# Altium project UCLA-DRS4-2.1.PrjPCB (part 1 of 7)
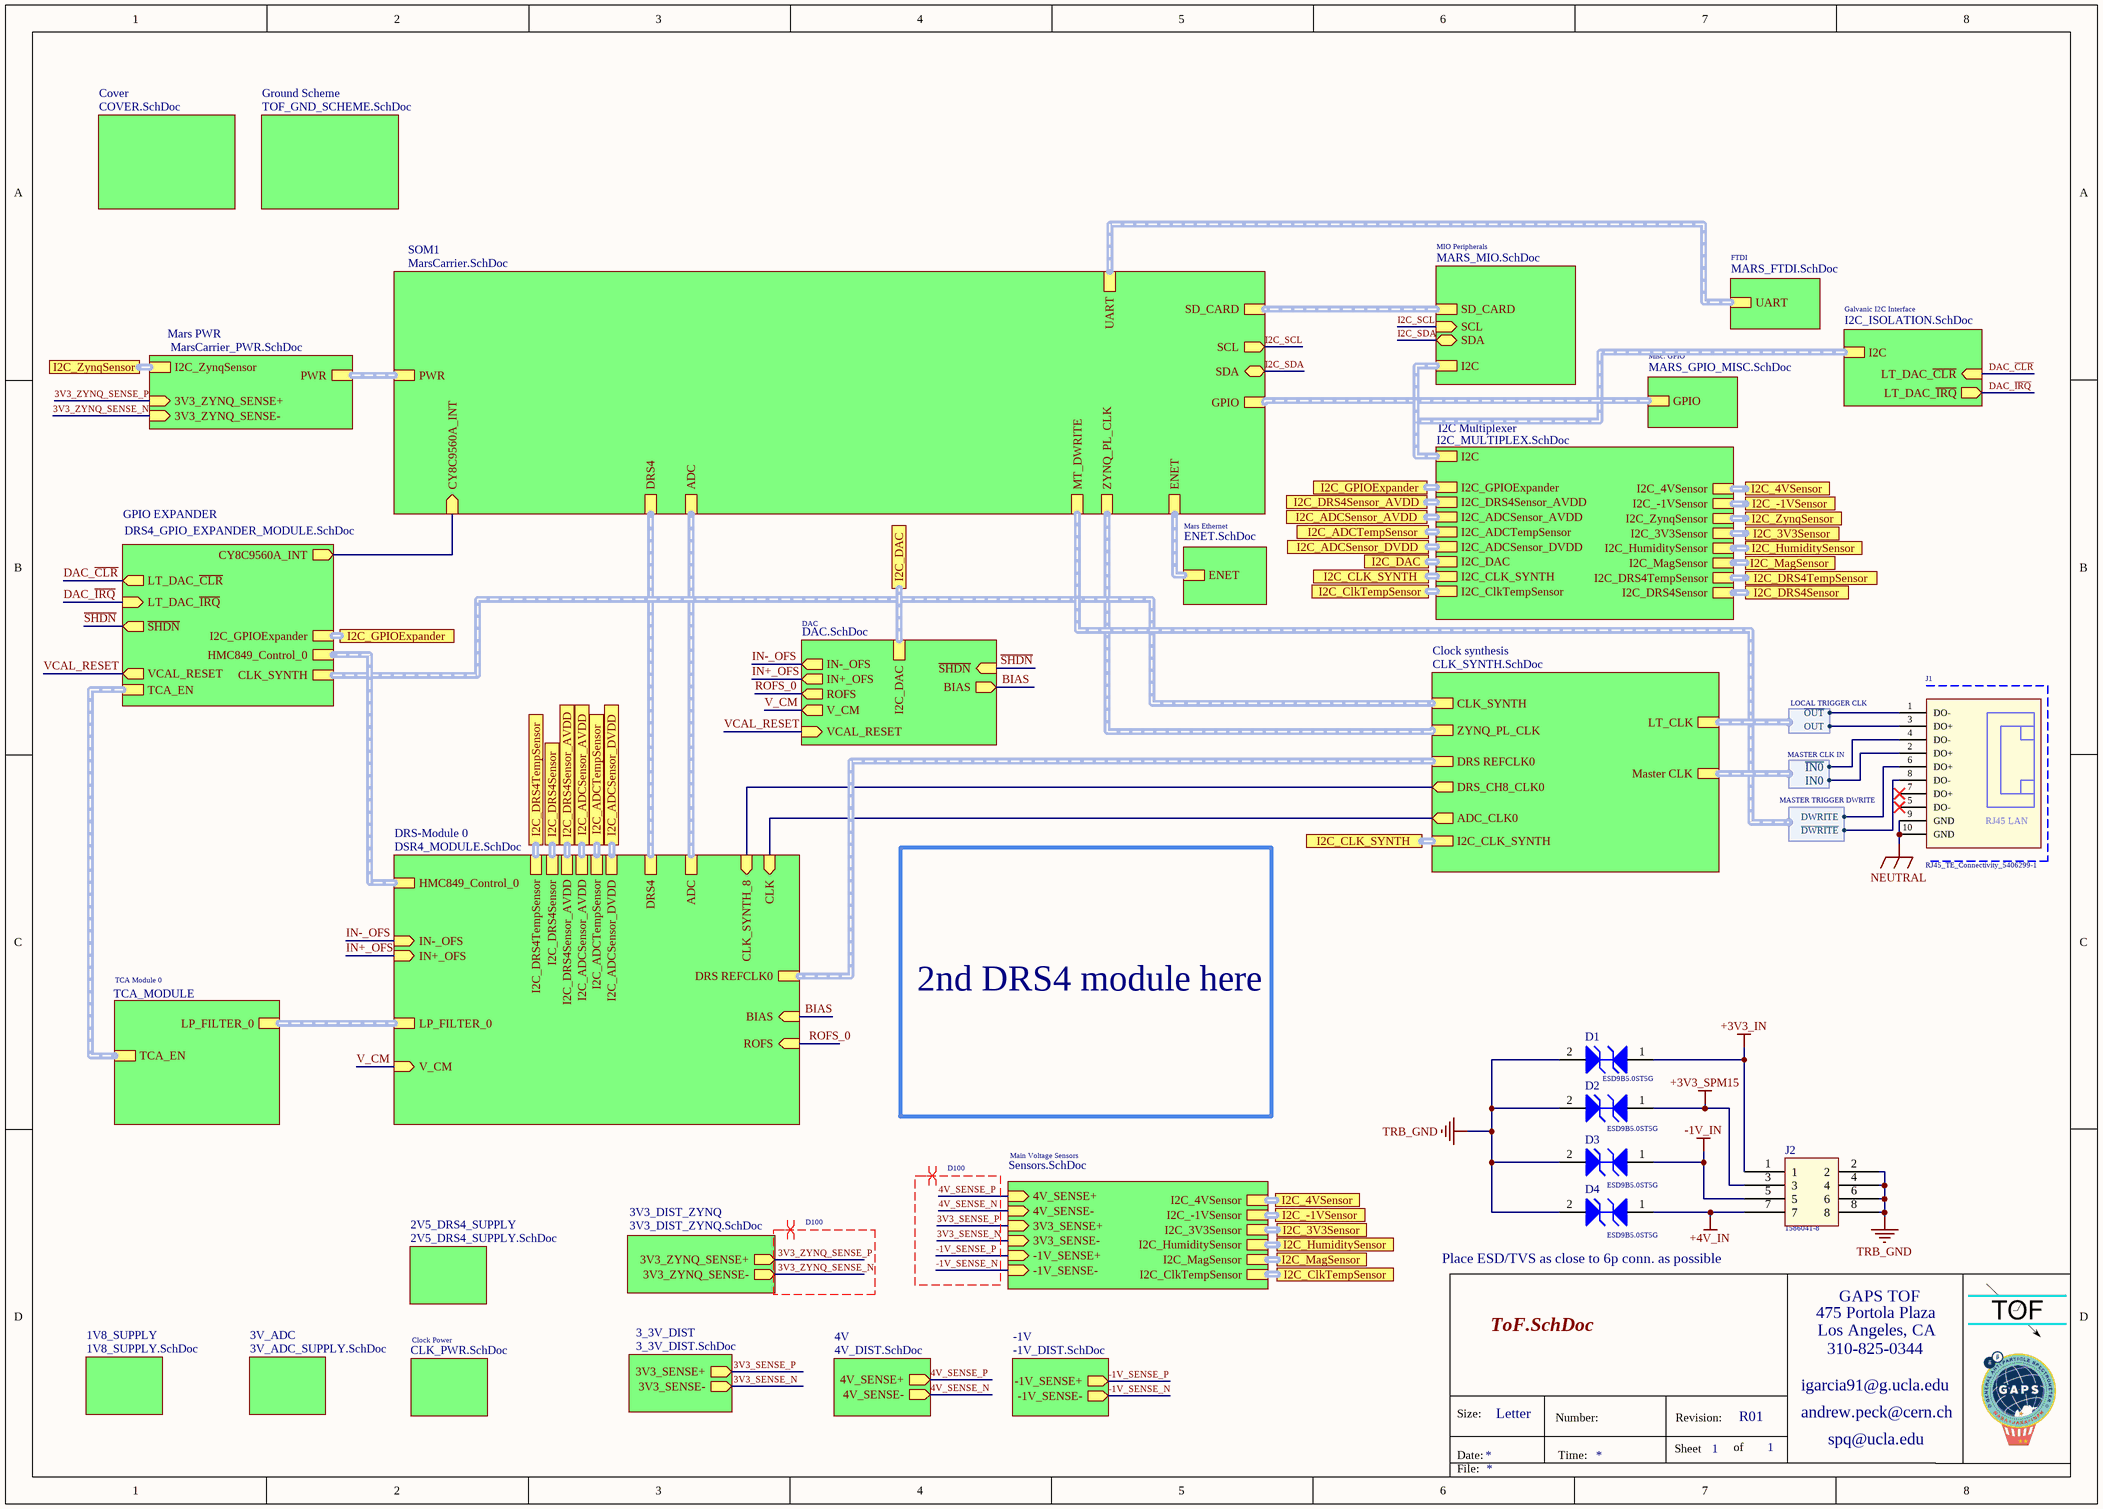
[diagram p0: ToF.SchDoc]
34 sheets, 1411 parts. Net scope: hierarchical (ports join the sheet entries above them; power ports are global).
Board file: DRS4-PCB.PcbDoc
Sheets:
  ToF.SchDoc
    DRS-Module 0 = DSR4_MODULE.SchDoc
      DRS1 = DRS4.SchDoc
      FE0 = ANA_FE.SchDoc
      ADC = DRS4_ADC.SchDoc
      FE2 = ANA_FE.SchDoc
      FE4 = ANA_FE.SchDoc
      FE6 = ANA_FE.SchDoc
      FE1 = ANA_FE.SchDoc
      FE3 = ANA_FE.SchDoc
      FE5 = ANA_FE.SchDoc
      FE7 = ANA_FE.SchDoc
      FE8 = ANA_FE_CLK_SYNTH.SchDoc
    SOM1 = MarsCarrier.SchDoc
    Mars Ethernet = ENET.SchDoc
    DAC = DAC.SchDoc
    Clock synthesis = CLK_SYNTH.SchDoc
    TCA Module 0 = TCA_MODULE.SchDoc
      TCA CLK = TCA_CLK_DIST.SchDoc
      TCA FILTER = TCA_LP_FILTER.SchDoc
    MIO Peripherals = MARS_MIO.SchDoc
    Clock Power = CLK_PWR.SchDoc
    2V5_DRS4_SUPPLY = 2V5_DRS4_SUPPLY.SchDoc
    4V = 4V_DIST.SchDoc
    -1V = -1V_DIST.SchDoc
    3V_ADC = 3V_ADC_SUPPLY.SchDoc
    Mars PWR = MarsCarrier_PWR.SchDoc
      MarsZX2 PWR Reset = MARS_PORB.SchDoc
    3V3_DIST_ZYNQ = 3V3_DIST_ZYNQ.SchDoc
    3_3V_DIST = 3_3V_DIST.SchDoc
    Main Voltage Sensors = Sensors.SchDoc
    Misc. GPIO = MARS_GPIO_MISC.SchDoc
    FTDI = MARS_FTDI.SchDoc
    GPIO EXPANDER = DRS4_GPIO_EXPANDER_MODULE.SchDoc
      I2C GPIO = DRS4_GPIO_EXPANDER.SchDoc
      I2C GPIO LED = GPIO_EXPANDER_LED.SchDoc
    Galvanic I2C Interface = I2C_ISOLATION.SchDoc
    I2C Multiplexer = I2C_MULTIPLEX.SchDoc
    1V8_SUPPLY = 1V8_SUPPLY.SchDoc
    Cover = COVER.SchDoc
    Ground Scheme = TOF_GND_SCHEME.SchDoc

## Sheet ToF.SchDoc: My title
size A3; Organization: University of California; Address1: 475 Portola Plaza; Address2: Los Angeles, CA 90095; Revision: R01; SheetNumber: 1; SheetTotal: 1

### Parts
D1  ESD9B5.0ST5G  [ONSC-SOD-923-2-514AB-01_V]
D2  ESD9B5.0ST5G  [ONSC-SOD-923-2-514AB-01_V]
D3  ESD9B5.0ST5G  [ONSC-SOD-923-2-514AB-01_V]
D4  ESD9B5.0ST5G  [ONSC-SOD-923-2-514AB-01_V]
J1  RJ45_TE_Connectivity_5406299-1  [RJ45_TE_Connectivity_5406299-1]
J2  Series: 1586041-8  [Header_TE_Connectivity_1586041-8_8POS]  (hidden comment: Header_TE_Connectivity_1586041-8_8POS)

### Sub-sheets
1V8_SUPPLY = 1V8_SUPPLY.SchDoc: no entries
2V5_DRS4_SUPPLY = 2V5_DRS4_SUPPLY.SchDoc: no entries
3_3V_DIST = 3_3V_DIST.SchDoc: 3V3_SENSE- (out), 3V3_SENSE+ (out)
3V3_DIST_ZYNQ = 3V3_DIST_ZYNQ.SchDoc: 3V3_ZYNQ_SENSE- (out), 3V3_ZYNQ_SENSE+ (out)
3V_ADC = 3V_ADC_SUPPLY.SchDoc: no entries
4V = 4V_DIST.SchDoc: 4V_SENSE- (out), 4V_SENSE+ (out)
-1V = -1V_DIST.SchDoc: -1V_SENSE- (out), -1V_SENSE+ (out)
Clock Power = CLK_PWR.SchDoc: no entries
Clock synthesis = CLK_SYNTH.SchDoc: CLK_SYNTH (harness CLK SYNTH CONTROL), ZYNQ_PL_CLK (harness ZYNQ PL CLK), DRS REFCLK0 (harness DRS4 REFCLK0), DRS_CH8_CLK0 (out), Master CLK (harness MASTER CLK IN), ADC_CLK0 (out), I2C_CLK_SYNTH (harness Clock Synth I2C), LT_CLK (harness LOCAL TRIGGER CLK)
Cover = COVER.SchDoc: no entries
DAC = DAC.SchDoc: I2C_DAC (harness DAC  I2C), IN-_OFS (out), IN+_OFS (out), ROFS (out), V_CM (out), VCAL_RESET (in), ~{SHDN} (in), BIAS (out)
DRS-Module 0 = DSR4_MODULE.SchDoc: ADC (harness ADC), DRS4 (harness DRS4), DRS REFCLK0 (harness DRS4 REFCLK 0), BIAS (in), ROFS (in), HMC849_Control_0 (harness HMC849 Control 0), LP_FILTER_0 (harness TCA Filter 0), V_CM (in), CLK_SYNTH_8 (in), IN-_OFS (in), IN+_OFS (in), CLK (in), I2C_DRS4TempSensor (harness Clk Synth Temp Sensor I2C), I2C_DRS4Sensor (harness DRS4 Current Sensor I2C), I2C_DRS4Sensor_AVDD (harness DRS4 Current Sensor I2C), I2C_ADCSensor_AVDD (harness ADC AVDD Current Sensor I2C), I2C_ADCTempSensor (harness ADC Temp Sensor I2C), I2C_ADCSensor_DVDD (harness ADC DVDD Current Sensor I2C)
FTDI = MARS_FTDI.SchDoc: UART (harness Mars UART)
Galvanic I2C Interface = I2C_ISOLATION.SchDoc: I2C (harness Mars I2C), LT_DAC_~{CLR} (in), LT_DAC_~{IRQ} (out)
GPIO EXPANDER = DRS4_GPIO_EXPANDER_MODULE.SchDoc: HMC849_Control_0 (harness HMC849 Control 0), CLK_SYNTH (harness CLK SYNTH CONTROL), TCA_EN (harness TCA EN), ~{SHDN} (out), VCAL_RESET (out), LT_DAC_~{CLR} (out), LT_DAC_~{IRQ} (in), CY8C9560A_INT (out), I2C_GPIOExpander (harness GPIO Expander I2C)
Ground Scheme = TOF_GND_SCHEME.SchDoc: no entries
I2C Multiplexer = I2C_MULTIPLEX.SchDoc: I2C (harness Mars I2C), I2C_4VSensor (harness 4V Current Sensor I2C), I2C_-1VSensor (harness -1V Current Sensor I2C), I2C_ZynqSensor (harness 3V3 Zynq Current Sensor I2C), I2C_3V3Sensor (harness 3V3 Current Sensor I2C), I2C_HumiditySensor (harness Humidity Sensor I2C), I2C_MagSensor (harness Magnetic Field Sensor I2C), I2C_DRS4TempSensor (harness DRS4 Temp Sensor I2C), I2C_DRS4Sensor (harness DRS4 Temp Sensor I2C), I2C_GPIOExpander (harness GPIO Expander I2C), I2C_DRS4Sensor_AVDD (harness DRS4 Current Sensor I2C), I2C_ADCSensor_AVDD (harness ADC AVDD Current Sensor I2C), I2C_ADCTempSensor (harness ADC Temp Sensor I2C), I2C_ADCSensor_DVDD (harness ADC DVDD Current Sensor I2C), I2C_DAC (harness DAC  I2C), I2C_CLK_SYNTH (harness Clock Synth I2C), I2C_ClkTempSensor (harness Clk Synth Temp Sensor I2C)
Main Voltage Sensors = Sensors.SchDoc: -1V_SENSE- (in), -1V_SENSE+ (in), 4V_SENSE- (in), 4V_SENSE+ (in), 3V3_SENSE- (in), 3V3_SENSE+ (in), I2C_4VSensor (harness 4V Current Sensor I2C), I2C_-1VSensor (harness -1V Current Sensor I2C), I2C_3V3Sensor (harness -1V Current Sensor I2C), I2C_HumiditySensor (harness -1V Current Sensor I2C), I2C_MagSensor (harness -1V Current Sensor I2C), I2C_ClkTempSensor (harness Clk Synth Temp Sensor I2C)
Mars Ethernet = ENET.SchDoc: ENET (harness Mars ENET)
Mars PWR = MarsCarrier_PWR.SchDoc: PWR (harness Mars Power), 3V3_ZYNQ_SENSE- (in), 3V3_ZYNQ_SENSE+ (in), I2C_ZynqSensor (harness -1V Current Sensor I2C)
MIO Peripherals = MARS_MIO.SchDoc: SD_CARD (harness Mars SD Card), SCL (in), SDA (bidir), I2C (harness Mars I2C)
Misc. GPIO = MARS_GPIO_MISC.SchDoc: GPIO (harness Misc. I/O)
SOM1 = MarsCarrier.SchDoc: ADC (harness ADC), DRS4 (harness DRS4), ZYNQ_PL_CLK (harness ZYNQ PL CLK), ENET (harness Mars ENET), SD_CARD (harness Mars SD Card), SCL (out), SDA (bidir), PWR (harness Mars Power), GPIO (harness Misc. I/O), UART (harness Mars UART), CY8C9560A_INT (in), MT_DWRITE (harness MASTER TRIGGER DWRITE)
TCA Module 0 = TCA_MODULE: LP_FILTER_0 (harness TCA Filter 0), TCA_EN (harness TCA EN)

### Ports
I2C_3V3Sensor (harness 3V3 Current Sensor I2C), I2C_4VSensor (harness 4V Current Sensor I2C), I2C_-1VSensor (harness -1V Current Sensor I2C), I2C_ADCSensor_AVDD (harness ADC AVDD Current Sensor I2C), I2C_ADCSensor_DVDD (harness ADC DVDD Current Sensor I2C), I2C_ADCTempSensor (harness ADC Temp Sensor I2C), I2C_CLK_SYNTH (harness Clock Synth I2C), I2C_ClkTempSensor (harness Clk Synth Temp Sensor I2C), I2C_DAC (harness DAC  I2C), I2C_DRS4Sensor (harness DRS4 Current Sensor I2C), I2C_DRS4Sensor_AVDD (harness DRS4 AVDD Current Sensor I2C), I2C_DRS4TempSensor (harness DRS4 Temp Sensor I2C), I2C_GPIOExpander (harness GPIO Expander I2C), I2C_HumiditySensor (harness Humidity Sensor I2C), I2C_MagSensor (harness Magnetic Field Sensor I2C), I2C_ZynqSensor (harness 3V3 Zynq Current Sensor I2C)

### Harnesses
MASTER CLK IN: IN0, ~{IN0}
LOCAL TRIGGER CLK: OUT, ~{OUT}
MASTER TRIGGER DWRITE: DWRITE, ~{DWRITE}

### Nets
+3V3_IN: D1.1(A1) J2.1
+3V3_SPM15: D2.1(A1) J2.3
+4V_IN: D4.1(A1) J2.7
-1V_IN: D3.1(A1) J2.5
NEUTRAL: J1.9(GND) J1.10(GND)
TRB_GND: D1.2(A2) D2.2(A2) D3.2(A2) D4.2(A2) J2.2 J2.4 J2.6 J2.8
3V3_SENSE_N: sheet 3_3V_DIST/3V3_SENSE-, sheet Main Voltage Sensors/3V3_SENSE-
3V3_SENSE_P: sheet 3_3V_DIST/3V3_SENSE+, sheet Main Voltage Sensors/3V3_SENSE+
3V3_ZYNQ_SENSE_N: sheet Mars PWR/3V3_ZYNQ_SENSE-, sheet 3V3_DIST_ZYNQ/3V3_ZYNQ_SENSE-
3V3_ZYNQ_SENSE_P: sheet Mars PWR/3V3_ZYNQ_SENSE+, sheet 3V3_DIST_ZYNQ/3V3_ZYNQ_SENSE+
4V_SENSE_N: sheet 4V/4V_SENSE-, sheet Main Voltage Sensors/4V_SENSE-
4V_SENSE_P: sheet 4V/4V_SENSE+, sheet Main Voltage Sensors/4V_SENSE+
-1V_SENSE_N: sheet -1V/-1V_SENSE-, sheet Main Voltage Sensors/-1V_SENSE-
-1V_SENSE_P: sheet -1V/-1V_SENSE+, sheet Main Voltage Sensors/-1V_SENSE+
ADC_CLK: sheet DRS-Module 0/CLK, sheet Clock synthesis/ADC_CLK0
BIAS: sheet DRS-Module 0/BIAS, sheet DAC/BIAS
CLK_SYNTH_8: sheet DRS-Module 0/CLK_SYNTH_8, sheet Clock synthesis/DRS_CH8_CLK0
DAC_~{CLR}: sheet GPIO EXPANDER/LT_DAC_~{CLR}, sheet Galvanic I2C Interface/LT_DAC_~{CLR}
DAC_~{IRQ}: sheet GPIO EXPANDER/LT_DAC_~{IRQ}, sheet Galvanic I2C Interface/LT_DAC_~{IRQ}
I2C_SCL: sheet SOM1/SCL, sheet MIO Peripherals/SCL
I2C_SDA: sheet SOM1/SDA, sheet MIO Peripherals/SDA
IN+_OFS: sheet DRS-Module 0/IN+_OFS, sheet DAC/IN+_OFS
IN-_OFS: sheet DRS-Module 0/IN-_OFS, sheet DAC/IN-_OFS  [project net ~{IN}~{_OFS}]
IO_B35_L3_N: J1.8(DO-) ; sheet SOM1/MT_DWRITE.~{DWRITE}
IO_B35_L3_P: J1.6(DO+) ; sheet SOM1/MT_DWRITE.DWRITE
IO_B35_L15_AD12_F20_N: sheet SOM1/CY8C9560A_INT, sheet GPIO EXPANDER/CY8C9560A_INT
MCLK_N: J1.4(DO-) ; sheet Clock synthesis/Master CLK.~{IN0}
MCLK_P: J1.2(DO+) ; sheet Clock synthesis/Master CLK.IN0
OUT9_N: J1.1(DO-) ; sheet Clock synthesis/LT_CLK.~{OUT}
OUT9_P: J1.3(DO+) ; sheet Clock synthesis/LT_CLK.OUT
ROFS_0: sheet DRS-Module 0/ROFS, sheet DAC/ROFS  [project net R-OFS]
~{SHDN}: sheet DAC/~{SHDN}, sheet GPIO EXPANDER/~{SHDN}
V_CM: sheet DRS-Module 0/V_CM, sheet DAC/V_CM
VCAL_RESET: sheet DAC/VCAL_RESET, sheet GPIO EXPANDER/VCAL_RESET

Not connected (* = marked no-connect by the designer): J1 5(DO-)* 7(DO+)*

### Buses and harness runs
harness port I2C_3V3Sensor = sheet I2C Multiplexer/I2C_3V3Sensor
harness port I2C_3V3Sensor = sheet Main Voltage Sensors/I2C_3V3Sensor
harness port I2C_4VSensor = sheet I2C Multiplexer/I2C_4VSensor
harness port I2C_4VSensor = sheet Main Voltage Sensors/I2C_4VSensor
harness port I2C_-1VSensor = sheet I2C Multiplexer/I2C_-1VSensor
harness port I2C_-1VSensor = sheet Main Voltage Sensors/I2C_-1VSensor
harness port I2C_ADCSensor_AVDD = sheet DRS-Module 0/I2C_ADCSensor_AVDD
harness port I2C_ADCSensor_AVDD = sheet I2C Multiplexer/I2C_ADCSensor_AVDD
harness port I2C_ADCSensor_DVDD = sheet DRS-Module 0/I2C_ADCSensor_DVDD
harness port I2C_ADCSensor_DVDD = sheet I2C Multiplexer/I2C_ADCSensor_DVDD
harness port I2C_ADCTempSensor = sheet DRS-Module 0/I2C_ADCTempSensor
harness port I2C_ADCTempSensor = sheet I2C Multiplexer/I2C_ADCTempSensor
harness port I2C_CLK_SYNTH = sheet Clock synthesis/I2C_CLK_SYNTH
harness port I2C_CLK_SYNTH = sheet I2C Multiplexer/I2C_CLK_SYNTH
harness port I2C_ClkTempSensor = sheet I2C Multiplexer/I2C_ClkTempSensor
harness port I2C_ClkTempSensor = sheet Main Voltage Sensors/I2C_ClkTempSensor
harness port I2C_DAC = sheet DAC/I2C_DAC
harness port I2C_DAC = sheet I2C Multiplexer/I2C_DAC
harness port I2C_DRS4Sensor = sheet DRS-Module 0/I2C_DRS4Sensor
harness port I2C_DRS4Sensor = sheet I2C Multiplexer/I2C_DRS4Sensor
harness port I2C_DRS4Sensor_AVDD = sheet DRS-Module 0/I2C_DRS4Sensor_AVDD
harness port I2C_DRS4Sensor_AVDD = sheet I2C Multiplexer/I2C_DRS4Sensor_AVDD
harness port I2C_DRS4TempSensor = sheet DRS-Module 0/I2C_DRS4TempSensor
harness port I2C_DRS4TempSensor = sheet I2C Multiplexer/I2C_DRS4TempSensor
harness port I2C_GPIOExpander = sheet GPIO EXPANDER/I2C_GPIOExpander
harness port I2C_GPIOExpander = sheet I2C Multiplexer/I2C_GPIOExpander
harness port I2C_HumiditySensor = sheet I2C Multiplexer/I2C_HumiditySensor
harness port I2C_HumiditySensor = sheet Main Voltage Sensors/I2C_HumiditySensor
harness port I2C_MagSensor = sheet I2C Multiplexer/I2C_MagSensor
harness port I2C_MagSensor = sheet Main Voltage Sensors/I2C_MagSensor
harness port I2C_ZynqSensor = sheet I2C Multiplexer/I2C_ZynqSensor
harness port I2C_ZynqSensor = sheet Mars PWR/I2C_ZynqSensor
harness sheet Clock synthesis/CLK_SYNTH = sheet GPIO EXPANDER/CLK_SYNTH
harness sheet Clock synthesis/DRS REFCLK0 = sheet DRS-Module 0/DRS REFCLK0
harness sheet Clock synthesis/ZYNQ_PL_CLK = sheet SOM1/ZYNQ_PL_CLK
harness sheet DRS-Module 0/ADC = sheet SOM1/ADC
harness sheet DRS-Module 0/DRS4 = sheet SOM1/DRS4
harness sheet DRS-Module 0/HMC849_Control_0 = sheet GPIO EXPANDER/HMC849_Control_0
harness sheet DRS-Module 0/LP_FILTER_0 = sheet TCA Module 0/LP_FILTER_0
harness sheet FTDI/UART = sheet SOM1/UART
harness sheet Galvanic I2C Interface/I2C = sheet I2C Multiplexer/I2C = sheet MIO Peripherals/I2C
harness sheet GPIO EXPANDER/TCA_EN = sheet TCA Module 0/TCA_EN
harness sheet Mars Ethernet/ENET = sheet SOM1/ENET
harness sheet Mars PWR/PWR = sheet SOM1/PWR
harness sheet MIO Peripherals/SD_CARD = sheet SOM1/SD_CARD
harness sheet Misc. GPIO/GPIO = sheet SOM1/GPIO

### Layout directives
differential pair; differential pair class D100: 3V3_SENSE_N, 3V3_SENSE_P, 3V3_ZYNQ_SENSE_N, 3V3_ZYNQ_SENSE_P, 4V_SENSE_N, 4V_SENSE_P, -1V_SENSE_N, -1V_SENSE_P

### Notes on the sheet
- 2nd DRS4 module here
- Place ESD/TVS as close to 6p conn. as possible
- 475 Portola Plaza
- GAPS TOF
- igarcia91@g.ucla.edu
- Los Angeles, CA
- 310-825-0344
- Size:
- Date:
- Letter
- Number:
- Time:
- Sheet
- Revision:
- of
- andrew.peck@cern.ch
- spq@ucla.edu
- File:
- (in symbol RJ45_TE_Connectivity_5406299-1) RJ45 LAN

### Library data of the parts
D1-D4 = ESD9B5.0ST5G: Transient Voltage Suppressor, Micro-Packaged Diode for ESD Protection, 2-Pin SOD-923, Pb-Free, Tape and Reel; Manufacturer: On Semiconductor; Direction: Bidirectional; VRWM Max (V): 5; V(BR) Min (V): 5.8; IR Max (uA): 1; ComponentLink1Description: Manufacturer URL; ComponentLink2Description: Datasheet; PartNumber: ESD9B5.0ST5G; ComponentLink3Description: Package Specification; PackageDescription: 2-Pin SOD, Body 0.8 x 0.6 mm; ComponentLink3URL: http://www.onsemi.com/pub_link/Collateral/514AB.PDF; DatasheetVersion: Rev. 2; ComponentLink1URL: http://www.onsemi.com/; PackageReference: SOD-923-2-514AB-01; Packing: Tape and Reel; PackageVersion: Rev. C, 03/2011; Mounting Technology: Surface Mount; Number of Lines: 1; ComponentLink2URL: http://www.onsemi.cn/pub_link/Collateral/ESD9B-D.PDF; RoHS: Pb-Free; Supplier 1: Mouser; Supplier Part Number 1: 863-ESD9B5.0ST5G
J1 = RJ45_TE_Connectivity_5406299-1: Modular Connectors / Ethernet Connectors 1 PORT CAT 5; Supplier 1: Mouser; Supplier Part Number 1: 571-5406299-1
J2 = Header_TE_Connectivity_1586041-8_8POS: Headers & Wire Housings RA HDR W/O PEGS 8P; Supplier Part Number 1: 571-15860418; Supplier 1: Mouser

## Sheet DSR4_MODULE.SchDoc: My title
size A3; Organization: University of California; Address1: 475 Portola Plaza; Address2: Los Angeles, CA 90095; Revision: R01; SheetNumber: 1; SheetTotal: 1
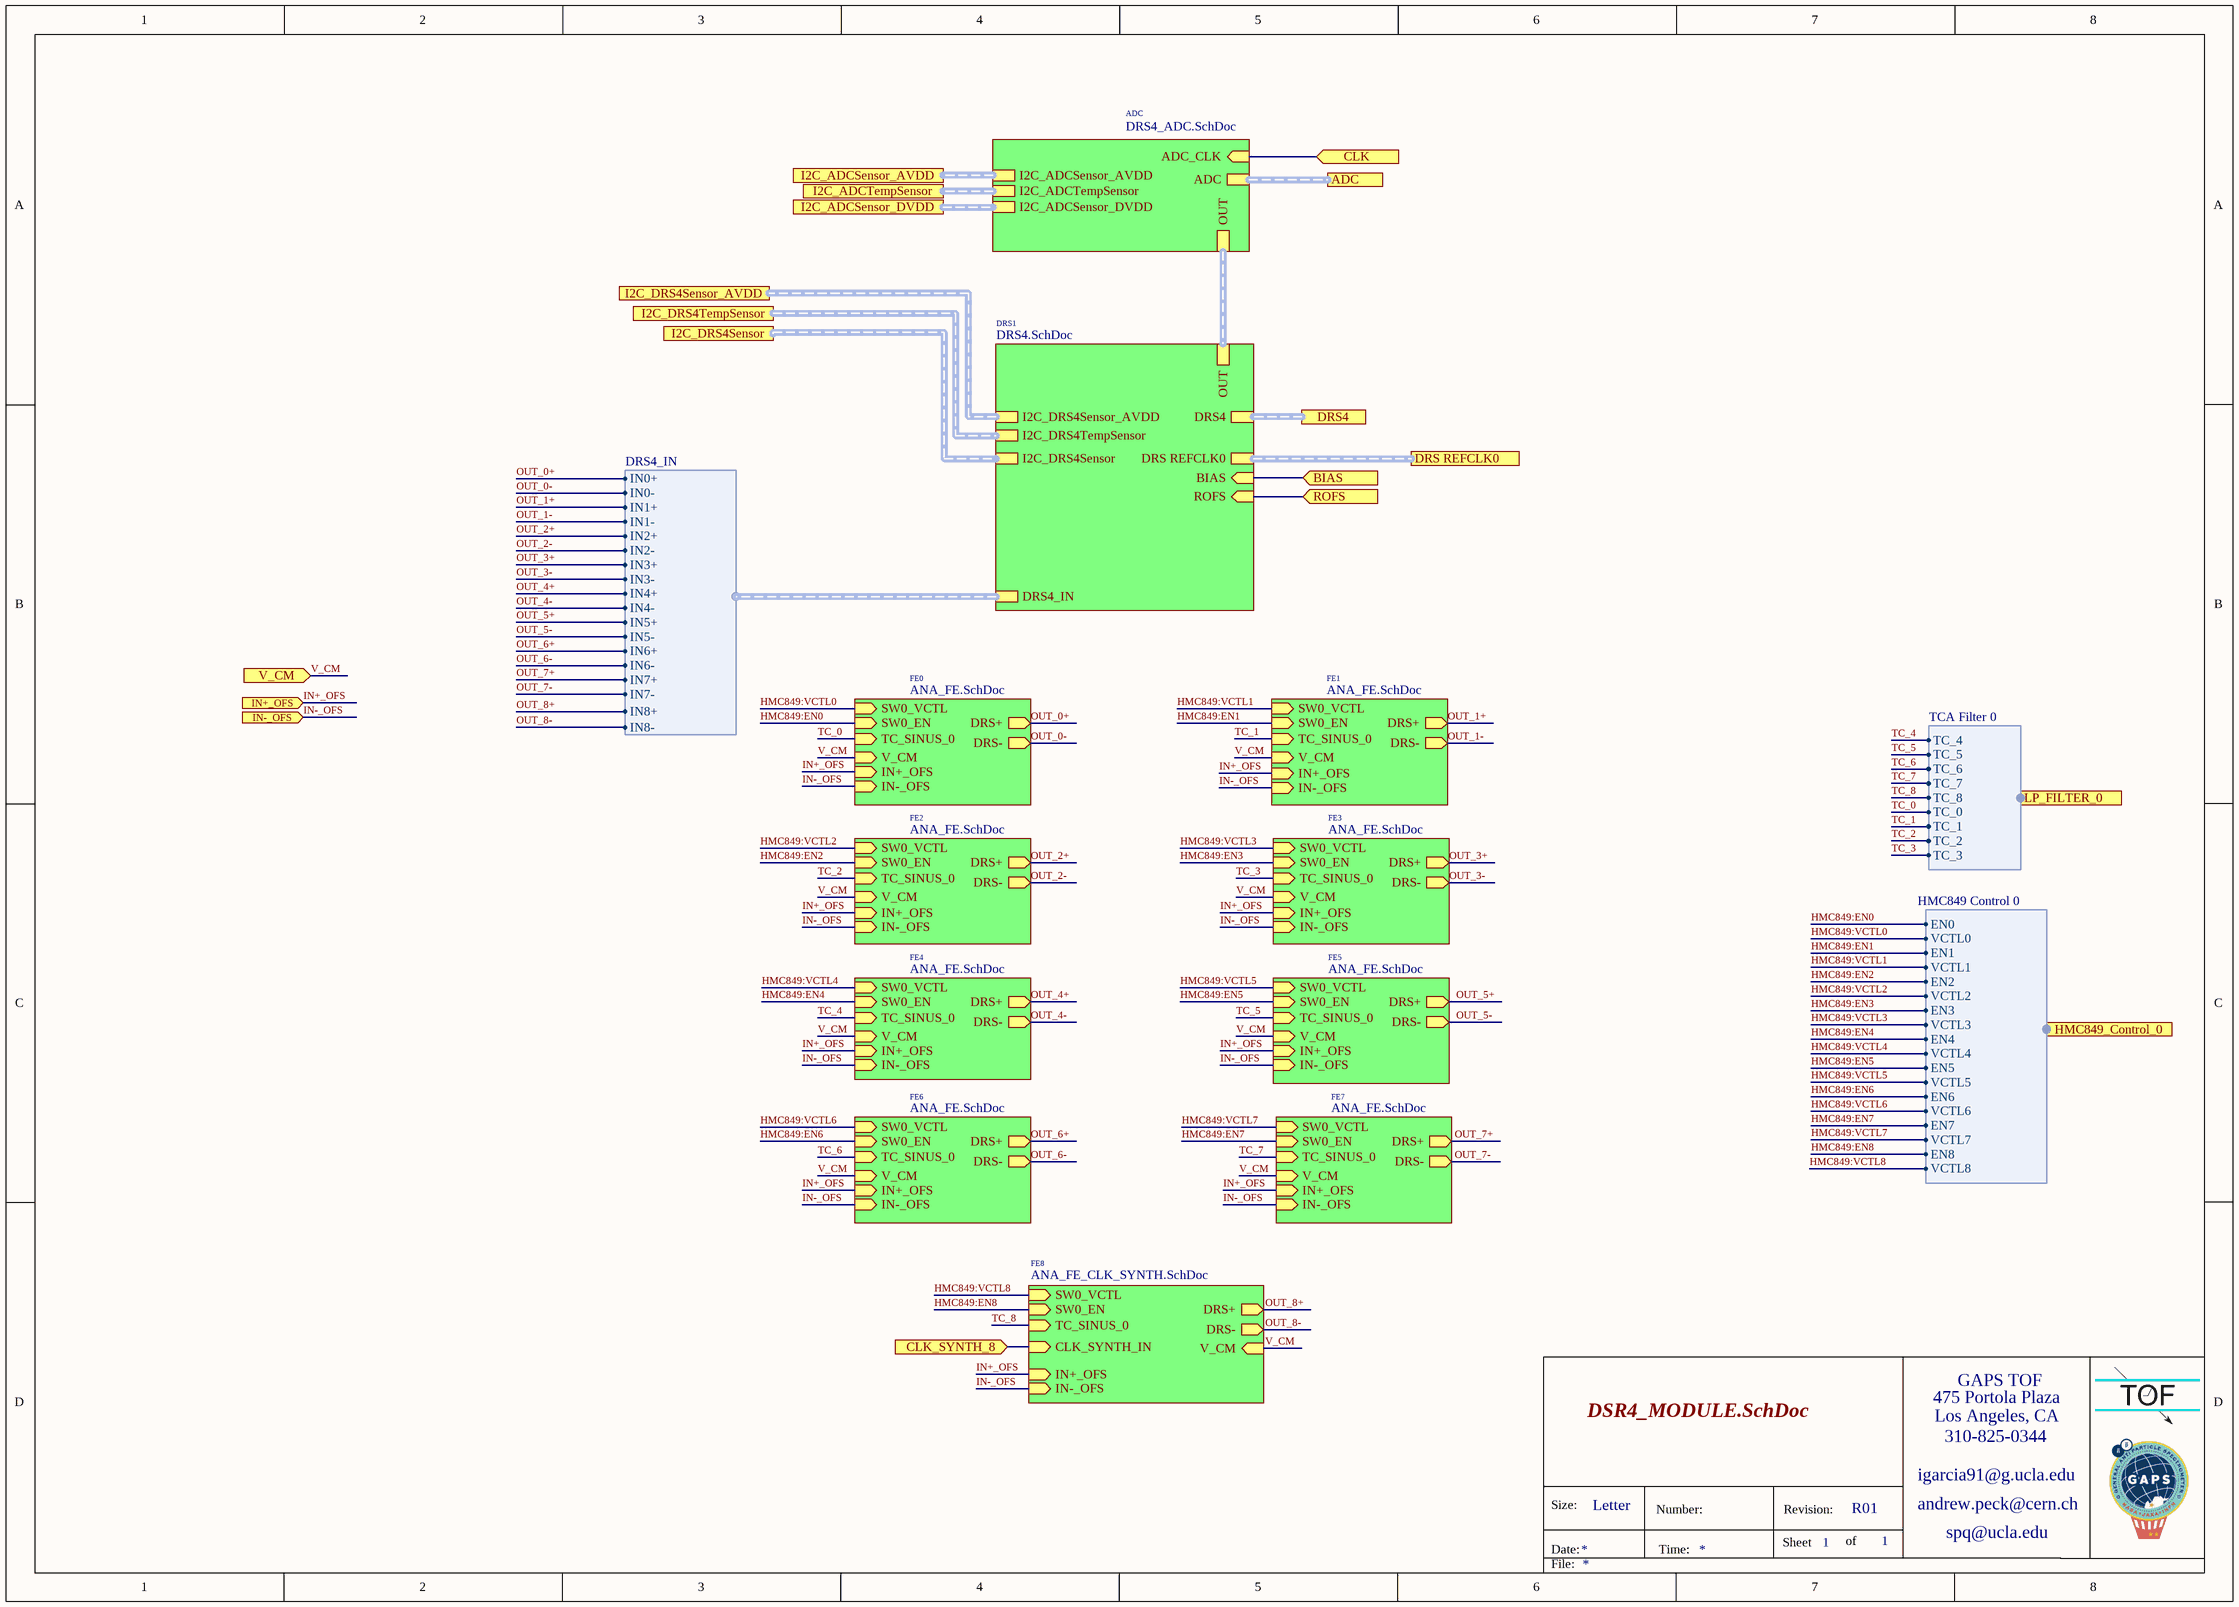
[diagram p1: DSR4_MODULE.SchDoc]

### Sub-sheets
ADC = DRS4_ADC.SchDoc: ADC (harness ADC), OUT (harness DRS4_OUT), ADC_CLK (in), I2C_ADCSensor_AVDD (harness ADC AVDD Current Sensor I2C), I2C_ADCTempSensor (harness ADC Temp Sensor I2C), I2C_ADCSensor_DVDD (harness ADC DVDD Current Sensor I2C)
DRS1 = DRS4.SchDoc: DRS4_IN (harness DRS4_IN), DRS4 (harness DRS4), OUT (harness DRS4_OUT), DRS REFCLK0 (harness DRS4 REFCLK0), BIAS (in), ROFS (in), I2C_DRS4TempSensor (harness DRS4 Temp Sensor I2C), I2C_DRS4Sensor (harness DRS4 Current Sensor I2C), I2C_DRS4Sensor_AVDD (harness DRS4 AVDD Current Sensor I2C)
FE0 = ANA_FE.SchDoc: DRS+ (out), DRS- (out), V_CM (in), SW0_VCTL (in), SW0_EN (in), TC_SINUS_0 (in), IN+_OFS (in), IN-_OFS (in)
FE1 = ANA_FE.SchDoc: DRS+ (out), DRS- (out), V_CM (in), SW0_VCTL (in), SW0_EN (in), TC_SINUS_0 (in), IN+_OFS (in), IN-_OFS (in)
FE2 = ANA_FE.SchDoc: DRS+ (out), DRS- (out), V_CM (in), SW0_VCTL (in), SW0_EN (in), TC_SINUS_0 (in), IN+_OFS (in), IN-_OFS (in)
FE3 = ANA_FE.SchDoc: DRS+ (out), DRS- (out), V_CM (in), SW0_VCTL (in), SW0_EN (in), TC_SINUS_0 (in), IN+_OFS (in), IN-_OFS (in)
FE4 = ANA_FE.SchDoc: DRS+ (out), DRS- (out), V_CM (in), SW0_VCTL (in), SW0_EN (in), TC_SINUS_0 (in), IN+_OFS (in), IN-_OFS (in)
FE5 = ANA_FE.SchDoc: DRS+ (out), DRS- (out), V_CM (in), SW0_VCTL (in), SW0_EN (in), TC_SINUS_0 (in), IN+_OFS (in), IN-_OFS (in)
FE6 = ANA_FE.SchDoc: DRS+ (out), DRS- (out), V_CM (in), SW0_VCTL (in), SW0_EN (in), TC_SINUS_0 (in), IN+_OFS (in), IN-_OFS (in)
FE7 = ANA_FE.SchDoc: DRS+ (out), DRS- (out), V_CM (in), SW0_VCTL (in), SW0_EN (in), TC_SINUS_0 (in), IN+_OFS (in), IN-_OFS (in)
FE8 = ANA_FE_CLK_SYNTH.SchDoc: DRS+ (out), DRS- (out), V_CM (in), SW0_VCTL (in), SW0_EN (in), TC_SINUS_0 (in), CLK_SYNTH_IN (in), IN+_OFS (in), IN-_OFS (in)

### Ports
ADC (harness ADC), BIAS (in), CLK (in), CLK_SYNTH_8 (in), DRS4 (harness DRS4_FPGA), DRS REFCLK0 (harness DRS4 REFCLK 0), HMC849_Control_0 (harness HMC849 Control 0), I2C_ADCSensor_AVDD (harness ADC AVDD Current Sensor I2C), I2C_ADCSensor_DVDD (harness ADC DVDD Current Sensor I2C), I2C_ADCTempSensor (harness ADC Temp Sensor I2C), I2C_DRS4Sensor (harness DRS4 Current Sensor I2C), I2C_DRS4Sensor_AVDD (harness DRS4 AVDD Current Sensor I2C), I2C_DRS4TempSensor (harness DRS4 Temp Sensor I2C), IN+_OFS (in), IN-_OFS (in), LP_FILTER_0 (harness TCA Filter 0), ROFS (in), V_CM (in)

### Harnesses
DRS4_IN: IN0+, IN0-, IN1+, IN1-, IN2+, IN2-, IN3+, IN3-, IN4+, IN4-, IN5+, IN5-, IN6+, IN6-, IN7+, IN7-, IN8+, IN8-
TCA Filter 0: TC_4, TC_5, TC_6, TC_7, TC_8, TC_0, TC_1, TC_2, TC_3
HMC849 Control 0: EN0, VCTL0, EN1, VCTL1, EN2, VCTL2, EN3, VCTL3, EN4, VCTL4, EN5, VCTL5, EN6, VCTL6, EN7, VCTL7, EN8, VCTL8

### Nets
ADC_CLK: port CLK, sheet ADC/ADC_CLK
BIAS: port BIAS, sheet DRS1/BIAS
CLK_SYNTH_8: port CLK_SYNTH_8, sheet FE8/CLK_SYNTH_IN
HMC849:EN0: sheet FE0/SW0_EN, port HMC849_Control_0.EN0
HMC849:EN1: sheet FE1/SW0_EN, port HMC849_Control_0.EN1
HMC849:EN2: sheet FE2/SW0_EN, port HMC849_Control_0.EN2
HMC849:EN3: sheet FE3/SW0_EN, port HMC849_Control_0.EN3
HMC849:EN4: sheet FE4/SW0_EN, port HMC849_Control_0.EN4
HMC849:EN5: sheet FE5/SW0_EN, port HMC849_Control_0.EN5
HMC849:EN6: sheet FE6/SW0_EN, port HMC849_Control_0.EN6
HMC849:EN7: sheet FE7/SW0_EN, port HMC849_Control_0.EN7
HMC849:EN8: sheet FE8/SW0_EN, port HMC849_Control_0.EN8
HMC849:VCTL0: sheet FE0/SW0_VCTL, port HMC849_Control_0.VCTL0
HMC849:VCTL1: sheet FE1/SW0_VCTL, port HMC849_Control_0.VCTL1
HMC849:VCTL2: sheet FE2/SW0_VCTL, port HMC849_Control_0.VCTL2
HMC849:VCTL3: sheet FE3/SW0_VCTL, port HMC849_Control_0.VCTL3
HMC849:VCTL4: sheet FE4/SW0_VCTL, port HMC849_Control_0.VCTL4
HMC849:VCTL5: sheet FE5/SW0_VCTL, port HMC849_Control_0.VCTL5
HMC849:VCTL6: sheet FE6/SW0_VCTL, port HMC849_Control_0.VCTL6
HMC849:VCTL7: sheet FE7/SW0_VCTL, port HMC849_Control_0.VCTL7
HMC849:VCTL8: sheet FE8/SW0_VCTL, port HMC849_Control_0.VCTL8
IN+_OFS: port IN+_OFS, sheet FE0/IN+_OFS, sheet FE2/IN+_OFS, sheet FE4/IN+_OFS, sheet FE6/IN+_OFS, sheet FE1/IN+_OFS, sheet FE3/IN+_OFS, sheet FE5/IN+_OFS, sheet FE7/IN+_OFS, sheet FE8/IN+_OFS
IN-_OFS: port IN-_OFS, sheet FE0/IN-_OFS, sheet FE2/IN-_OFS, sheet FE4/IN-_OFS, sheet FE6/IN-_OFS, sheet FE1/IN-_OFS, sheet FE3/IN-_OFS, sheet FE5/IN-_OFS, sheet FE7/IN-_OFS, sheet FE8/IN-_OFS  [project net ~{IN}~{_OFS}]
OUT_0+: sheet FE0/DRS+, sheet DRS1/DRS4_IN.IN0+  [project net DRS4_IN0_P]
OUT_0-: sheet FE0/DRS-, sheet DRS1/DRS4_IN.IN0-  [project net DRS4_IN0_N]
OUT_1+: sheet FE1/DRS+, sheet DRS1/DRS4_IN.IN1+  [project net DRS4_IN1_P]
OUT_1-: sheet FE1/DRS-, sheet DRS1/DRS4_IN.IN1-  [project net DRS4_IN1_N]
OUT_2+: sheet FE2/DRS+, sheet DRS1/DRS4_IN.IN2+  [project net DRS4_IN2_P]
OUT_2-: sheet FE2/DRS-, sheet DRS1/DRS4_IN.IN2-  [project net DRS4_IN2_N]
OUT_3+: sheet FE3/DRS+, sheet DRS1/DRS4_IN.IN3+  [project net DRS4_IN3_P]
OUT_3-: sheet FE3/DRS-, sheet DRS1/DRS4_IN.IN3-  [project net DRS4_IN3_N]
OUT_4+: sheet FE4/DRS+, sheet DRS1/DRS4_IN.IN4+  [project net DRS4_IN4_P]
OUT_4-: sheet FE4/DRS-, sheet DRS1/DRS4_IN.IN4-  [project net DRS4_IN4_N]
OUT_5+: sheet FE5/DRS+, sheet DRS1/DRS4_IN.IN5+  [project net DRS4_IN5_P]
OUT_5-: sheet FE5/DRS-, sheet DRS1/DRS4_IN.IN5-  [project net DRS4_IN5_N]
OUT_6+: sheet FE6/DRS+, sheet DRS1/DRS4_IN.IN6+  [project net DRS4_IN6_P]
OUT_6-: sheet FE6/DRS-, sheet DRS1/DRS4_IN.IN6-  [project net DRS4_IN6_N]
OUT_7+: sheet FE7/DRS+, sheet DRS1/DRS4_IN.IN7+  [project net DRS4_IN7_P]
OUT_7-: sheet FE7/DRS-, sheet DRS1/DRS4_IN.IN7-  [project net DRS4_IN7_N]
OUT_8+: sheet FE8/DRS+, sheet DRS1/DRS4_IN.IN8+  [project net DRS4_IN8_P]
OUT_8-: sheet FE8/DRS-, sheet DRS1/DRS4_IN.IN8-  [project net DRS4_IN8_N]
R-OFS: port ROFS, sheet DRS1/ROFS
TC_0: sheet FE0/TC_SINUS_0, port LP_FILTER_0.TC_0
TC_1: sheet FE1/TC_SINUS_0, port LP_FILTER_0.TC_1
TC_2: sheet FE2/TC_SINUS_0, port LP_FILTER_0.TC_2
TC_3: sheet FE3/TC_SINUS_0, port LP_FILTER_0.TC_3
TC_4: sheet FE4/TC_SINUS_0, port LP_FILTER_0.TC_4
TC_5: sheet FE5/TC_SINUS_0, port LP_FILTER_0.TC_5
TC_6: sheet FE6/TC_SINUS_0, port LP_FILTER_0.TC_6
TC_7: sheet FE7/TC_SINUS_0, port LP_FILTER_0.TC_7
TC_8: sheet FE8/TC_SINUS_0, port LP_FILTER_0.TC_8
V_CM: port V_CM, sheet FE0/V_CM, sheet FE2/V_CM, sheet FE4/V_CM, sheet FE6/V_CM, sheet FE1/V_CM, sheet FE3/V_CM, sheet FE5/V_CM, sheet FE7/V_CM, sheet FE8/V_CM

### Buses and harness runs
harness port ADC = sheet ADC/ADC
harness port DRS4 = sheet DRS1/DRS4
harness port DRS REFCLK0 = sheet DRS1/DRS REFCLK0
harness port I2C_ADCSensor_AVDD = sheet ADC/I2C_ADCSensor_AVDD
harness port I2C_ADCSensor_DVDD = sheet ADC/I2C_ADCSensor_DVDD
harness port I2C_ADCTempSensor = sheet ADC/I2C_ADCTempSensor
harness port I2C_DRS4Sensor = sheet DRS1/I2C_DRS4Sensor
harness port I2C_DRS4Sensor_AVDD = sheet DRS1/I2C_DRS4Sensor_AVDD
harness port I2C_DRS4TempSensor = sheet DRS1/I2C_DRS4TempSensor
harness sheet ADC/OUT = sheet DRS1/OUT

### Notes on the sheet
- 475 Portola Plaza
- GAPS TOF
- igarcia91@g.ucla.edu
- Los Angeles, CA
- 310-825-0344
- Size:
- Date:
- Letter
- Number:
- Time:
- Sheet
- Revision:
- of
- andrew.peck@cern.ch
- spq@ucla.edu
- File:

## Sheet DRS4.SchDoc: My title
size A3; Organization: University of California; Address1: 475 Portola Plaza; Address2: Los Angeles, CA 90095; Revision: R01; SheetNumber: 1; SheetTotal: 1
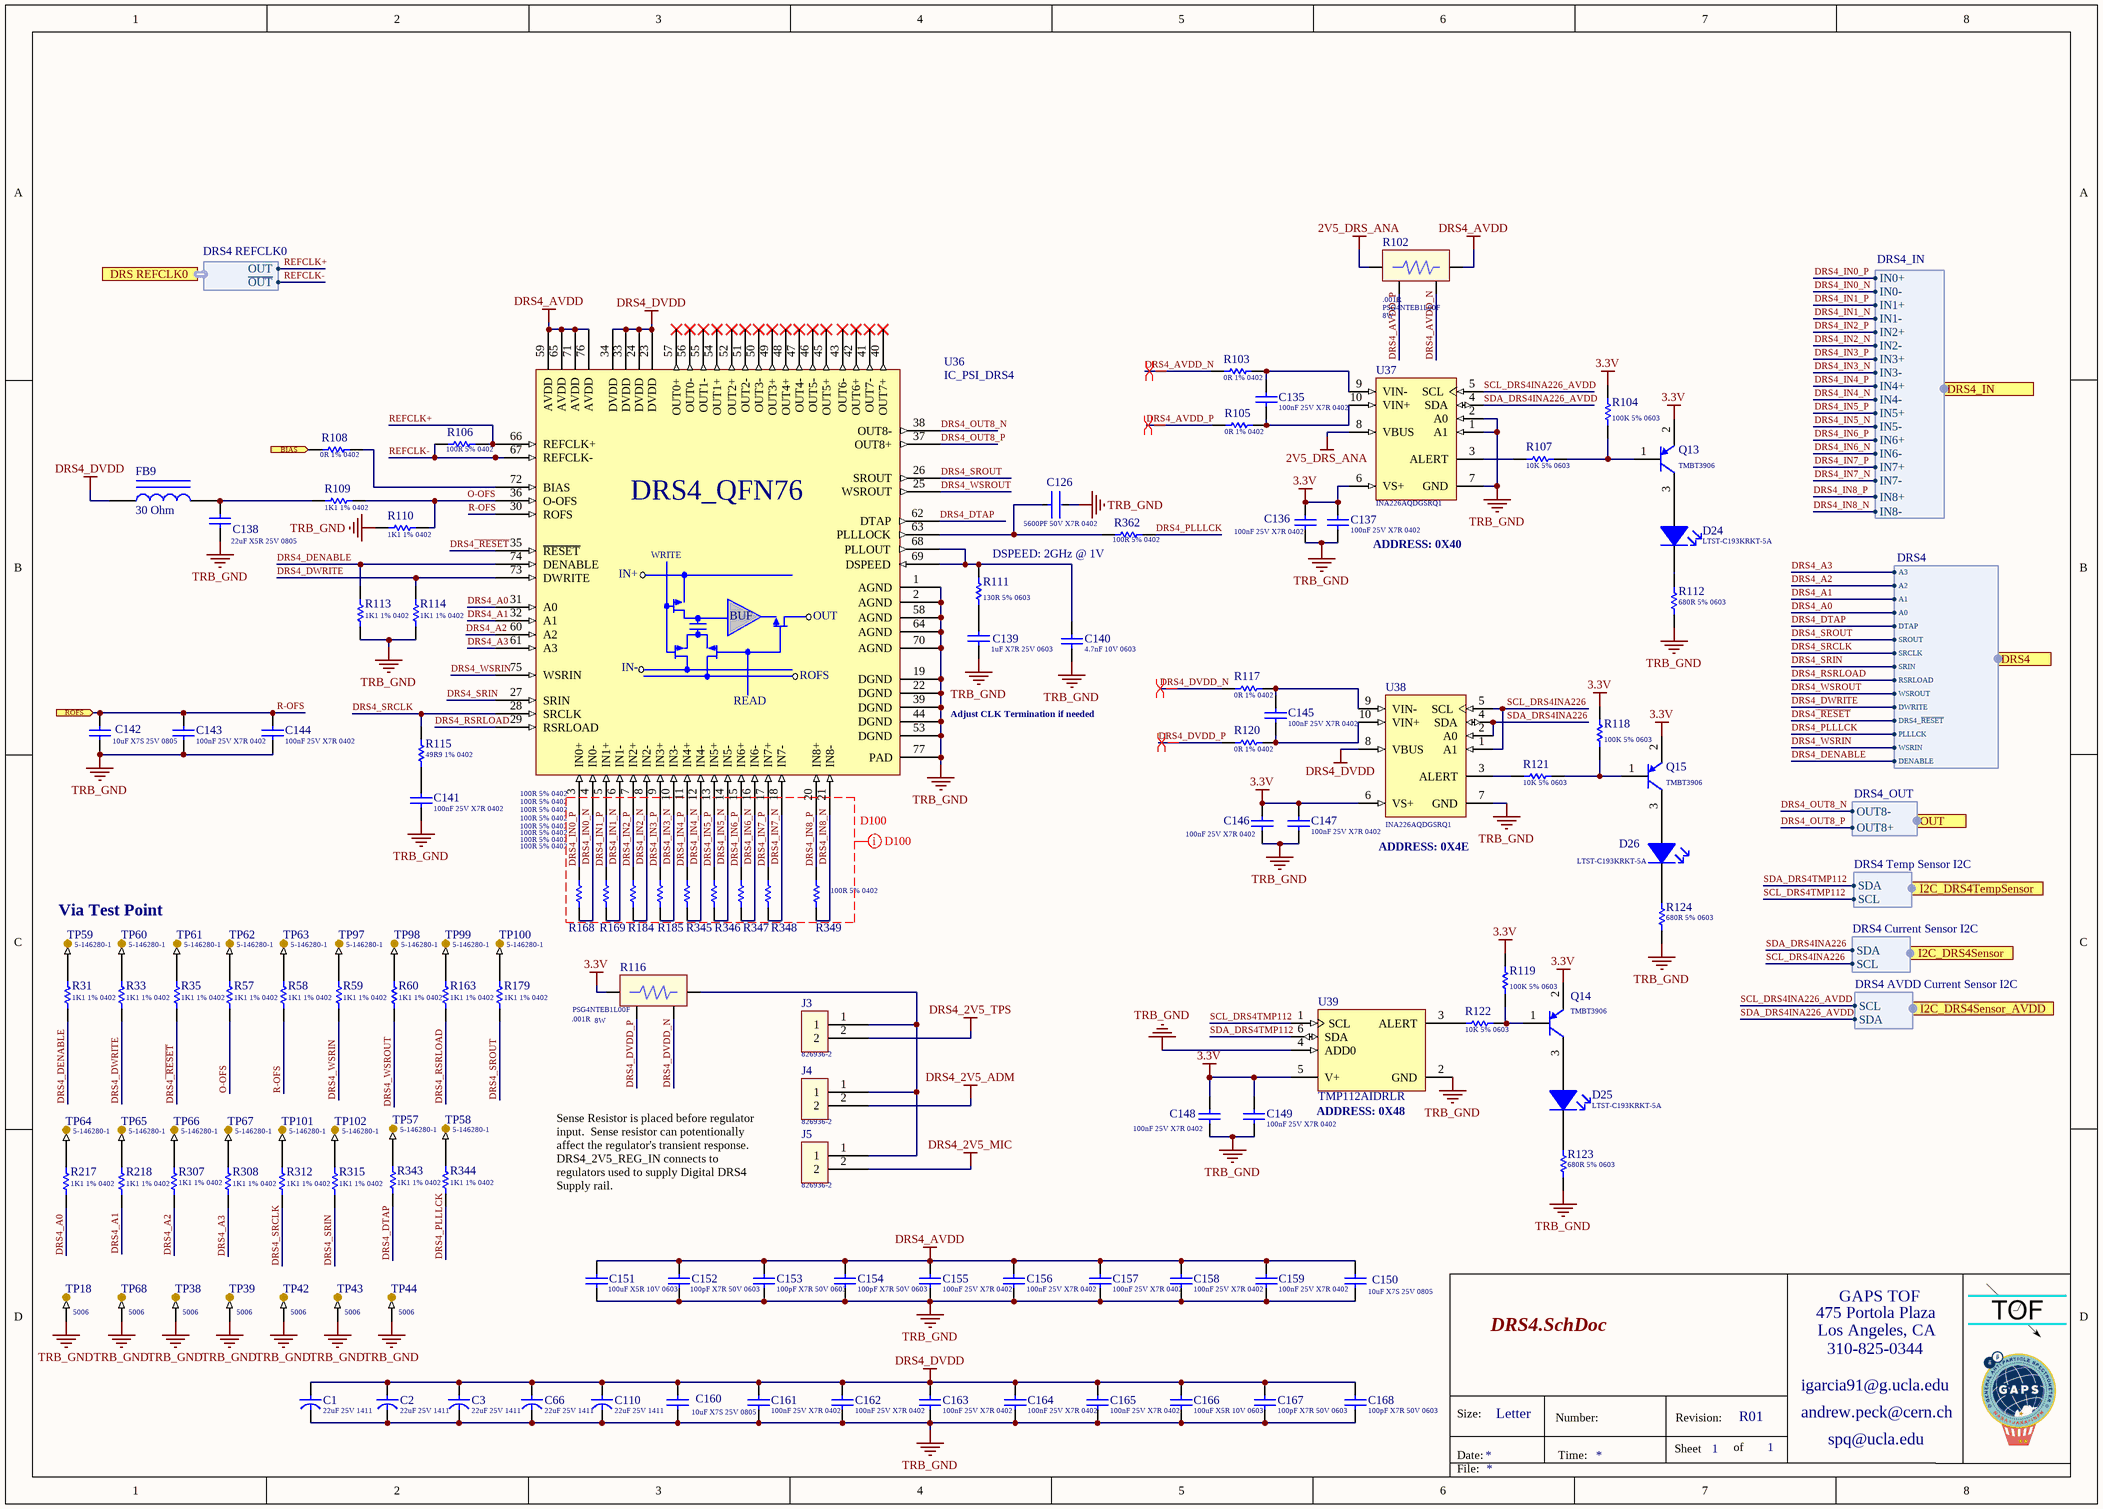
[diagram p2: DRS4.SchDoc]

### Parts
C1  Capacitance: 22uF 25V 1411  [Cap_Kemet_T521B226M025ATE100_22uF]  (hidden comment: Cap_Kemet_T521B226M025ATE100_22uF)
C2  Capacitance: 22uF 25V 1411  [Cap_Kemet_T521B226M025ATE100_22uF]  (hidden comment: Cap_Kemet_T521B226M025ATE100_22uF)
C3  Capacitance: 22uF 25V 1411  [Cap_Kemet_T521B226M025ATE100_22uF]  (hidden comment: Cap_Kemet_T521B226M025ATE100_22uF)
C66  Capacitance: 22uF 25V 1411  [Cap_Kemet_T521B226M025ATE100_22uF]  (hidden comment: Cap_Kemet_T521B226M025ATE100_22uF)
C110  Capacitance: 22uF 25V 1411  [Cap_Kemet_T521B226M025ATE100_22uF]  (hidden comment: Cap_Kemet_T521B226M025ATE100_22uF)
C126  5600PF 50V X7R 0402  [FP-C0402-BB-MFG]
C135  Capacitance: 100nF 25V X7R 0402  [Cap_Taiyo_Yuden_TMK105B7104KV-FR_100nF]  (hidden comment: Cap_Taiyo_Yuden_TMK105B7104KV-FR_100nF)
C136  Capacitance: 100nF 25V X7R 0402  [Cap_Taiyo_Yuden_TMK105B7104KV-FR_100nF]  (hidden comment: Cap_Taiyo_Yuden_TMK105B7104KV-FR_100nF)
C137  Capacitance: 100nF 25V X7R 0402  [Cap_Taiyo_Yuden_TMK105B7104KV-FR_100nF]  (hidden comment: Cap_Taiyo_Yuden_TMK105B7104KV-FR_100nF)
C138  Capacitance: 22uF X5R 25V 0805  [Cap_Murata_GRT21BR61E226ME13L_22uF]  (hidden comment: Cap_Murata_GRT21BR61E226ME13L_22uF)
C139  Capacitance: 1uF X7R 25V 0603  [Cap_Murata_GCJ188R71E105KA01J_1uF]  (hidden comment: Cap_Murata_GCJ188R71E105KA01J_1uF)
C140  4.7nF 10V 0603  [CAPC0603(1608)100_L]
C141  Capacitance: 100nF 25V X7R 0402  [Cap_Taiyo_Yuden_TMK105B7104KV-FR_100nF]  (hidden comment: Cap_Taiyo_Yuden_TMK105B7104KV-FR_100nF)
C142  Capacitance: 10uF X7S 25V 0805  [Cap_Murata_ GRM21BC71E106ME11L_10uF]  (hidden comment: Cap_Murata_ GRM21BC71E106ME11L_10uF)
C143  Capacitance: 100nF 25V X7R 0402  [Cap_Taiyo_Yuden_TMK105B7104KV-FR_100nF]  (hidden comment: Cap_Taiyo_Yuden_TMK105B7104KV-FR_100nF)
C144  Capacitance: 100nF 25V X7R 0402  [Cap_Taiyo_Yuden_TMK105B7104KV-FR_100nF]  (hidden comment: Cap_Taiyo_Yuden_TMK105B7104KV-FR_100nF)
C145  Capacitance: 100nF 25V X7R 0402  [Cap_Taiyo_Yuden_TMK105B7104KV-FR_100nF]  (hidden comment: Cap_Taiyo_Yuden_TMK105B7104KV-FR_100nF)
C146  Capacitance: 100nF 25V X7R 0402  [Cap_Taiyo_Yuden_TMK105B7104KV-FR_100nF]  (hidden comment: Cap_Taiyo_Yuden_TMK105B7104KV-FR_100nF)
C147  Capacitance: 100nF 25V X7R 0402  [Cap_Taiyo_Yuden_TMK105B7104KV-FR_100nF]  (hidden comment: Cap_Taiyo_Yuden_TMK105B7104KV-FR_100nF)
C148  Capacitance: 100nF 25V X7R 0402  [Cap_Taiyo_Yuden_TMK105B7104KV-FR_100nF]  (hidden comment: Cap_Taiyo_Yuden_TMK105B7104KV-FR_100nF)
C149  Capacitance: 100nF 25V X7R 0402  [Cap_Taiyo_Yuden_TMK105B7104KV-FR_100nF]  (hidden comment: Cap_Taiyo_Yuden_TMK105B7104KV-FR_100nF)
C150  Capacitance: 10uF X7S 25V 0805  [Cap_Murata_ GRM21BC71E106ME11L_10uF]  (hidden comment: Cap_Murata_ GRM21BC71E106ME11L_10uF)
C151  Capacitance: 100uF X5R 10V 0603  [Cap_Murata_GRM31CR61A107ME05L_100uF]  (hidden comment: Cap_Murata_GRM31CR61A107ME05L_100uF)
C152  Capacitance: 100pF X7R 50V 0603  [Cap_Kemet_C0603C101J5RACTU_100pF]  (hidden comment: Cap_Kemet_C0603C101J5RACTU_100pF)
C153  Capacitance: 100pF X7R 50V 0603  [Cap_Kemet_C0603C101J5RACTU_100pF]  (hidden comment: Cap_Kemet_C0603C101J5RACTU_100pF)
C154  Capacitance: 100pF X7R 50V 0603  [Cap_Kemet_C0603C101J5RACTU_100pF]  (hidden comment: Cap_Kemet_C0603C101J5RACTU_100pF)
C155  Capacitance: 100nF 25V X7R 0402  [Cap_Taiyo_Yuden_TMK105B7104KV-FR_100nF]  (hidden comment: Cap_Taiyo_Yuden_TMK105B7104KV-FR_100nF)
C156  Capacitance: 100nF 25V X7R 0402  [Cap_Taiyo_Yuden_TMK105B7104KV-FR_100nF]  (hidden comment: Cap_Taiyo_Yuden_TMK105B7104KV-FR_100nF)
C157  Capacitance: 100nF 25V X7R 0402  [Cap_Taiyo_Yuden_TMK105B7104KV-FR_100nF]  (hidden comment: Cap_Taiyo_Yuden_TMK105B7104KV-FR_100nF)
C158  Capacitance: 100nF 25V X7R 0402  [Cap_Taiyo_Yuden_TMK105B7104KV-FR_100nF]  (hidden comment: Cap_Taiyo_Yuden_TMK105B7104KV-FR_100nF)
C159  Capacitance: 100nF 25V X7R 0402  [Cap_Taiyo_Yuden_TMK105B7104KV-FR_100nF]  (hidden comment: Cap_Taiyo_Yuden_TMK105B7104KV-FR_100nF)
C160  Capacitance: 10uF X7S 25V 0805  [Cap_Murata_ GRM21BC71E106ME11L_10uF]  (hidden comment: Cap_Murata_ GRM21BC71E106ME11L_10uF)
C161  Capacitance: 100nF 25V X7R 0402  [Cap_Taiyo_Yuden_TMK105B7104KV-FR_100nF]  (hidden comment: Cap_Taiyo_Yuden_TMK105B7104KV-FR_100nF)
C162  Capacitance: 100nF 25V X7R 0402  [Cap_Taiyo_Yuden_TMK105B7104KV-FR_100nF]  (hidden comment: Cap_Taiyo_Yuden_TMK105B7104KV-FR_100nF)
C163  Capacitance: 100nF 25V X7R 0402  [Cap_Taiyo_Yuden_TMK105B7104KV-FR_100nF]  (hidden comment: Cap_Taiyo_Yuden_TMK105B7104KV-FR_100nF)
C164  Capacitance: 100nF 25V X7R 0402  [Cap_Taiyo_Yuden_TMK105B7104KV-FR_100nF]  (hidden comment: Cap_Taiyo_Yuden_TMK105B7104KV-FR_100nF)
C165  Capacitance: 100nF 25V X7R 0402  [Cap_Taiyo_Yuden_TMK105B7104KV-FR_100nF]  (hidden comment: Cap_Taiyo_Yuden_TMK105B7104KV-FR_100nF)
C166  Capacitance: 100uF X5R 10V 0603  [Cap_Murata_GRM31CR61A107ME05L_100uF]  (hidden comment: Cap_Murata_GRM31CR61A107ME05L_100uF)
C167  Capacitance: 100pF X7R 50V 0603  [Cap_Kemet_C0603C101J5RACTU_100pF]  (hidden comment: Cap_Kemet_C0603C101J5RACTU_100pF)
C168  Capacitance: 100pF X7R 50V 0603  [Cap_Kemet_C0603C101J5RACTU_100pF]  (hidden comment: Cap_Kemet_C0603C101J5RACTU_100pF)
D24  LTST-C193KRKT-5A  [Led_Lite-On_LTST-C193KGKT-5A_Red]
D25  LTST-C193KRKT-5A  [Led_Lite-On_LTST-C193KGKT-5A_Red]
D26  LTST-C193KRKT-5A  [Led_Lite-On_LTST-C193KGKT-5A_Red]
FB9  30 Ohm  [Feb_MURATA_BLM15AX300SZ1D_30]
J3  Series: 826936-2  [Header_TE_Connectivity_826936-2_2POS_5A]  (hidden comment: Header_TE_Connectivity_826936-2_2POS_5A)
J4  Series: 826936-2  [Header_TE_Connectivity_826936-2_2POS_5A]  (hidden comment: Header_TE_Connectivity_826936-2_2POS_5A)
J5  Series: 826936-2  [Header_TE_Connectivity_826936-2_2POS_5A]  (hidden comment: Header_TE_Connectivity_826936-2_2POS_5A)
Q13  Series: TMBT3906  [BJT_PNP_Toshiba_TMBT3906]  (hidden comment: BJT_PNP_Toshiba_TMBT3906)
Q14  Series: TMBT3906  [BJT_PNP_Toshiba_TMBT3906]  (hidden comment: BJT_PNP_Toshiba_TMBT3906)
Q15  Series: TMBT3906  [BJT_PNP_Toshiba_TMBT3906]  (hidden comment: BJT_PNP_Toshiba_TMBT3906)
R31  1K1 1% 0402  [RESC0402(1005)_L]
R33  1K1 1% 0402  [RESC0402(1005)_L]
R35  1K1 1% 0402  [RESC0402(1005)_L]
R57  1K1 1% 0402  [RESC0402(1005)_L]
R58  1K1 1% 0402  [RESC0402(1005)_L]
R59  1K1 1% 0402  [RESC0402(1005)_L]
R60  1K1 1% 0402  [RESC0402(1005)_L]
R102  Resistance: .001R  Series: PSG4NTEB1L00F  Parameter 1: 8W  [SRes_KOA_PSG4NTEB1L00F_1mOhm]  (hidden comment: SRes_KOA_PSG4NTEB1L00F_1mOhm)
R103  Resistance: 0R 1% 0402  [Res_Vishay_CRCW04020000Z0EDC_0_Ohm]  (hidden comment: Res_Vishay_CRCW04020000Z0EDC_0_Ohm)
R104  100K 5% 0603  [RESC0603(1608)_N]
R105  Resistance: 0R 1% 0402  [Res_Vishay_CRCW04020000Z0EDC_0_Ohm]  (hidden comment: Res_Vishay_CRCW04020000Z0EDC_0_Ohm)
R106  100R 5% 0402  [RESC0402(1005)_L]
R107  10K 5% 0603  [RESC0603(1608)_L]
R108  Resistance: 0R 1% 0402  [Res_Vishay_CRCW04020000Z0EDC_0_Ohm]  (hidden comment: Res_Vishay_CRCW04020000Z0EDC_0_Ohm)
R109  1K1 1% 0402  [RESC0402(1005)_L]
R110  1K1 1% 0402  [RESC0402(1005)_L]
R111  130R 5% 0603  [RESC0603(1608)_L]
R112  680R 5% 0603  [RESC0603(1608)_L]
R113  1K1 1% 0402  [RESC0402(1005)_L]
R114  1K1 1% 0402  [RESC0402(1005)_L]
R115  49R9 1% 0402  [RESC0402(1005)_L]
R116  Resistance: .001R  Series: PSG4NTEB1L00F  Parameter 1: 8W  [SRes_KOA_PSG4NTEB1L00F_1mOhm]  (hidden comment: SRes_KOA_PSG4NTEB1L00F_1mOhm)
R117  Resistance: 0R 1% 0402  [Res_Vishay_CRCW04020000Z0EDC_0_Ohm]  (hidden comment: Res_Vishay_CRCW04020000Z0EDC_0_Ohm)
R118  100K 5% 0603  [RESC0603(1608)_N]
R119  100K 5% 0603  [RESC0603(1608)_N]
R120  Resistance: 0R 1% 0402  [Res_Vishay_CRCW04020000Z0EDC_0_Ohm]  (hidden comment: Res_Vishay_CRCW04020000Z0EDC_0_Ohm)
R121  10K 5% 0603  [RESC0603(1608)_L]
R122  10K 5% 0603  [RESC0603(1608)_L]
R123  680R 5% 0603  [RESC0603(1608)_L]
R124  680R 5% 0603  [RESC0603(1608)_L]
R163  1K1 1% 0402  [RESC0402(1005)_L]
R168  100R 5% 0402  [RESC0402(1005)_L]
R169  100R 5% 0402  [RESC0402(1005)_L]
R179  1K1 1% 0402  [RESC0402(1005)_L]
R184  100R 5% 0402  [RESC0402(1005)_L]
R185  100R 5% 0402  [RESC0402(1005)_L]
R217  1K1 1% 0402  [RESC0402(1005)_L]
R218  1K1 1% 0402  [RESC0402(1005)_L]
R307  1K1 1% 0402  [RESC0402(1005)_L]
R308  1K1 1% 0402  [RESC0402(1005)_L]
R312  1K1 1% 0402  [RESC0402(1005)_L]
R315  1K1 1% 0402  [RESC0402(1005)_L]
R343  1K1 1% 0402  [RESC0402(1005)_L]
R344  1K1 1% 0402  [RESC0402(1005)_L]
R345  100R 5% 0402  [RESC0402(1005)_L]
R346  100R 5% 0402  [RESC0402(1005)_L]
R347  100R 5% 0402  [RESC0402(1005)_L]
R348  100R 5% 0402  [RESC0402(1005)_L]
R349  100R 5% 0402  [RESC0402(1005)_L]
R362  100R 5% 0402  [RESC0402(1005)_L]
TP18  Series: 5006  [TP_Keystone_Electronics_5006]  (hidden comment: TP_Keystone_Electronics_5006)
TP38  Series: 5006  [TP_Keystone_Electronics_5006]  (hidden comment: TP_Keystone_Electronics_5006)
TP39  Series: 5006  [TP_Keystone_Electronics_5006]  (hidden comment: TP_Keystone_Electronics_5006)
TP42  Series: 5006  [TP_Keystone_Electronics_5006]  (hidden comment: TP_Keystone_Electronics_5006)
TP43  Series: 5006  [TP_Keystone_Electronics_5006]  (hidden comment: TP_Keystone_Electronics_5006)
TP44  Series: 5006  [TP_Keystone_Electronics_5006]  (hidden comment: TP_Keystone_Electronics_5006)
TP57  Series: 5-146280-1  [TP_TE_Connectivity_5-146280-1_1POS]  (hidden comment: TP_TE_Connectivity_5-146280-1_1POS)
TP58  Series: 5-146280-1  [TP_TE_Connectivity_5-146280-1_1POS]  (hidden comment: TP_TE_Connectivity_5-146280-1_1POS)
TP59  Series: 5-146280-1  [TP_TE_Connectivity_5-146280-1_1POS]  (hidden comment: TP_TE_Connectivity_5-146280-1_1POS)
TP60  Series: 5-146280-1  [TP_TE_Connectivity_5-146280-1_1POS]  (hidden comment: TP_TE_Connectivity_5-146280-1_1POS)
TP61  Series: 5-146280-1  [TP_TE_Connectivity_5-146280-1_1POS]  (hidden comment: TP_TE_Connectivity_5-146280-1_1POS)
TP62  Series: 5-146280-1  [TP_TE_Connectivity_5-146280-1_1POS]  (hidden comment: TP_TE_Connectivity_5-146280-1_1POS)
TP63  Series: 5-146280-1  [TP_TE_Connectivity_5-146280-1_1POS]  (hidden comment: TP_TE_Connectivity_5-146280-1_1POS)
TP64  Series: 5-146280-1  [TP_TE_Connectivity_5-146280-1_1POS]  (hidden comment: TP_TE_Connectivity_5-146280-1_1POS)
TP65  Series: 5-146280-1  [TP_TE_Connectivity_5-146280-1_1POS]  (hidden comment: TP_TE_Connectivity_5-146280-1_1POS)
TP66  Series: 5-146280-1  [TP_TE_Connectivity_5-146280-1_1POS]  (hidden comment: TP_TE_Connectivity_5-146280-1_1POS)
TP67  Series: 5-146280-1  [TP_TE_Connectivity_5-146280-1_1POS]  (hidden comment: TP_TE_Connectivity_5-146280-1_1POS)
TP68  Series: 5006  [TP_Keystone_Electronics_5006]  (hidden comment: TP_Keystone_Electronics_5006)
TP97  Series: 5-146280-1  [TP_TE_Connectivity_5-146280-1_1POS]  (hidden comment: TP_TE_Connectivity_5-146280-1_1POS)
TP98  Series: 5-146280-1  [TP_TE_Connectivity_5-146280-1_1POS]  (hidden comment: TP_TE_Connectivity_5-146280-1_1POS)
TP99  Series: 5-146280-1  [TP_TE_Connectivity_5-146280-1_1POS]  (hidden comment: TP_TE_Connectivity_5-146280-1_1POS)
TP100  Series: 5-146280-1  [TP_TE_Connectivity_5-146280-1_1POS]  (hidden comment: TP_TE_Connectivity_5-146280-1_1POS)
TP101  Series: 5-146280-1  [TP_TE_Connectivity_5-146280-1_1POS]  (hidden comment: TP_TE_Connectivity_5-146280-1_1POS)
TP102  Series: 5-146280-1  [TP_TE_Connectivity_5-146280-1_1POS]  (hidden comment: TP_TE_Connectivity_5-146280-1_1POS)
U36  IC_PSI_DRS4  [DRS4]
U37  INA226AQDGSRQ1  [INA226AQDGSRQ1]
U38  INA226AQDGSRQ1  [INA226AQDGSRQ1]
U39  TMP112AIDRLR  [TMP112AIDRLR]

### Ports
BIAS (in), DRS4 (harness DRS4), DRS4_IN (harness DRS4_IN), DRS REFCLK0 (harness DRS4 REFCLK0), I2C_DRS4Sensor (harness DRS4 Current Sensor I2C), I2C_DRS4Sensor_AVDD (harness DRS4 AVDD Current Sensor I2C), I2C_DRS4TempSensor (harness DRS4 Temp Sensor I2C), OUT (harness DRS4_OUT), ROFS (in)

### Harnesses
DRS4: A3, A2, A1, A0, DTAP, SROUT, SRCLK, SRIN, RSRLOAD, WSROUT, DWRITE, DRS4_~{RESET}, PLLLCK, WSRIN, DENABLE
DRS4_IN: IN0+, IN0-, IN1+, IN1-, IN2+, IN2-, IN3+, IN3-, IN4+, IN4-, IN5+, IN5-, IN6+, IN6-, IN7+, IN7-, IN8+, IN8-
DRS4_OUT: OUT8+, OUT8-
DRS4 REFCLK0: OUT, ~{OUT}
DRS4 Temp Sensor I2C: SCL, SDA
DRS4 Current Sensor I2C: SCL, SDA
DRS4 AVDD Current Sensor I2C: SCL, SDA

### Nets
2V5_DRS_ANA: R102.1 U37.8(VBUS)
3.3V: C136.2 C137.2 C146.2 C147.2 C148.2 C149.2 Q13.2(E) Q14.2(E) Q15.2(E) R104.2 R116.1 R118.2 R119.2 U37.6(VS+) U38.6(VS+) U39.5(V+)
DRS4_2V5_ADM: J4.2
DRS4_2V5_MIC: J5.2
DRS4_2V5_TPS: J3.2
DRS4_AVDD: C150.1 C151.2 C152.1 C153.1 C154.1 C155.2 C156.2 C157.2 C158.2 C159.2 R102.2 U36.59(AVDD) U36.65(AVDD) U36.71(AVDD) U36.76(AVDD)
DRS4_DVDD: C1.1 C2.1 C3.1 C66.1 C110.1 C160.1 C161.2 C162.2 C163.2 C164.2 C165.2 C166.2 C167.1 C168.1 FB9.1 U36.23(DVDD) U36.24(DVDD) U36.33(DVDD) U36.34(DVDD) U38.8(VBUS)
TRB_GND: C1.2 C2.2 C3.2 C66.2 C110.2 C126.2 C136.1 C137.1 C138.1 C139.1 C140.1 C141.1 C142.2 C143.1 C144.1 C146.1 C147.1 C148.1 C149.1 C150.2 C151.1 C152.2 C153.2 C154.2 C155.1 C156.1 C157.1 C158.1 C159.1 C160.2 C161.1 C162.1 C163.1 C164.1 C165.1 C166.1 C167.2 C168.2 R110.2 R112.1 R113.1 R114.1 R123.1 R124.1 TP18.1 TP38.1 TP39.1 TP42.1 TP43.1 TP44.1 TP68.1 U36.1(AGND) U36.2(AGND) U36.19(DGND) U36.22(DGND) U36.39(DGND) U36.44(DGND) U36.53(DGND) U36.58(AGND) U36.64(AGND) U36.70(AGND) U36.77(PAD) U37.1(A1) U37.2(A0) U37.7(GND) U38.7(GND) U39.2(GND) U39.4(ADD0)
BIAS: R108.1 ; port BIAS
DRS4~{_RESET}: R35.1 U36.35(~{RESET}) ; port DRS4.DRS4_~{RESET}
DRS4_A0: R217.1 U36.31(A0) ; port DRS4.A0
DRS4_A1: R218.1 U36.32(A1) ; port DRS4.A1
DRS4_A2: R307.2 U36.60(A2) ; port DRS4.A2
DRS4_A3: R308.1 U36.61(A3) ; port DRS4.A3
DRS4_AVDD_N: R102.3 R103.1
DRS4_AVDD_P: R102.4 R105.1
DRS4_DENABLE: R31.1 R113.2 U36.74(DENABLE) ; port DRS4.DENABLE
DRS4_DTAP: R343.1 U36.62(DTAP) ; port DRS4.DTAP
DRS4_DVDD_N: R116.3 R117.1
DRS4_DVDD_P: R116.4 R120.1
DRS4_DWRITE: R33.1 R114.2 U36.73(DWRITE) ; port DRS4.DWRITE
DRS4_IN0_N: R168.2 U36.4(IN0-) ; port DRS4_IN.IN0-
DRS4_IN0_P: R168.1 U36.3(IN0+) ; port DRS4_IN.IN0+
DRS4_IN1_N: R169.2 U36.6(IN1-) ; port DRS4_IN.IN1-
DRS4_IN1_P: R169.1 U36.5(IN1+) ; port DRS4_IN.IN1+
DRS4_IN2_N: R184.2 U36.8(IN2-) ; port DRS4_IN.IN2-
DRS4_IN2_P: R184.1 U36.7(IN2+) ; port DRS4_IN.IN2+
DRS4_IN3_N: R185.2 U36.10(IN3-) ; port DRS4_IN.IN3-
DRS4_IN3_P: R185.1 U36.9(IN3+) ; port DRS4_IN.IN3+
DRS4_IN4_N: R345.2 U36.12(IN4-) ; port DRS4_IN.IN4-
DRS4_IN4_P: R345.1 U36.11(IN4+) ; port DRS4_IN.IN4+
DRS4_IN5_N: R346.2 U36.14(IN5-) ; port DRS4_IN.IN5-
DRS4_IN5_P: R346.1 U36.13(IN5+) ; port DRS4_IN.IN5+
DRS4_IN6_N: R347.2 U36.16(IN6-) ; port DRS4_IN.IN6-
DRS4_IN6_P: R347.1 U36.15(IN6+) ; port DRS4_IN.IN6+
DRS4_IN7_N: R348.2 U36.18(IN7-) ; port DRS4_IN.IN7-
DRS4_IN7_P: R348.1 U36.17(IN7+) ; port DRS4_IN.IN7+
DRS4_IN8_N: R349.2 U36.21(IN8-) ; port DRS4_IN.IN8-
DRS4_IN8_P: R349.1 U36.20(IN8+) ; port DRS4_IN.IN8+
DRS4_OUT8_N: U36.38(OUT8-) ; port OUT.OUT8-
DRS4_OUT8_P: U36.37(OUT8+) ; port OUT.OUT8+
DRS4_PLLLCK: R344.1 R362.1 ; port DRS4.PLLLCK
DRS4_RSRLOAD: R163.1 U36.29(RSRLOAD) ; port DRS4.RSRLOAD
DRS4_SRCLK: R115.1 R312.1 U36.28(SRCLK) ; port DRS4.SRCLK
DRS4_SRIN: R315.1 U36.27(SRIN) ; port DRS4.SRIN
DRS4_SROUT: R179.1 U36.26(SROUT) ; port DRS4.SROUT
DRS4_WSRIN: R59.1 U36.75(WSRIN) ; port DRS4.WSRIN
DRS4_WSROUT: R60.1 U36.25(WSROUT) ; port DRS4.WSROUT
O-OFS: R57.1 R109.1 R110.1 U36.36(O-OFS)
R-OFS: C142.1 C143.2 C144.2 R58.1 U36.30(ROFS) ; port ROFS
REFCLK+: R106.1 U36.66(REFCLK+) ; port DRS REFCLK0.OUT  [project net OUT1_P]
REFCLK-: R106.2 U36.67(REFCLK-) ; port DRS REFCLK0.~{OUT}  [project net OUT1_N]
SCL_DRS4INA226: U38.1(A1) U38.5(SCL) ; port I2C_DRS4Sensor.SCL
SCL_DRS4INA226_AVDD: U37.5(SCL) ; port I2C_DRS4Sensor_AVDD.SCL
SCL_DRS4TMP112: U39.1(SCL) ; port I2C_DRS4TempSensor.SCL
SDA_DRS4INA226: U38.2(A0) U38.4(SDA) ; port I2C_DRS4Sensor.SDA
SDA_DRS4INA226_AVDD: U37.4(SDA) ; port I2C_DRS4Sensor_AVDD.SDA
SDA_DRS4TMP112: U39.6(SDA) ; port I2C_DRS4TempSensor.SDA
NetC126_1: C126.1 R362.2 U36.63(PLLLOCK)
NetC135_1: C135.1 R105.2 U37.10(VIN+)
NetC135_2: C135.2 R103.2 U37.9(VIN-)
NetC138_2: C138.2 FB9.2 R109.2
NetC139_2: C139.2 R111.1
NetC140_2: C140.2 R111.2 U36.68(PLLOUT) U36.69(DSPEED)
NetC141_2: C141.2 R115.2
NetC145_1: C145.1 R120.2 U38.10(VIN+)
NetC145_2: C145.2 R117.2 U38.9(VIN-)
NetD24_1: D24.1(K) R112.2
NetD24_2: D24.2(A) Q13.3(C)
NetD25_1: D25.1(K) R123.2
NetD25_2: D25.2(A) Q14.3(C)
NetD26_1: D26.1(K) R124.2
NetD26_2: D26.2(A) Q15.3(C)
NetJ3_1: J3.1 J4.1 J5.1 R116.2
NetQ13_1: Q13.1(B) R104.1 R107.1
NetQ14_1: Q14.1(B) R119.1 R122.1
NetQ15_1: Q15.1(B) R118.1 R121.1
NetR31_2: R31.2 TP59.1
NetR33_2: R33.2 TP60.1
NetR35_2: R35.2 TP61.1
NetR57_2: R57.2 TP62.1
NetR58_2: R58.2 TP63.1
NetR59_2: R59.2 TP97.1
NetR60_2: R60.2 TP98.1
NetR107_2: R107.2 U37.3(ALERT)
NetR108_2: R108.2 U36.72(BIAS)
NetR121_2: R121.2 U38.3(ALERT)
NetR122_2: R122.2 U39.3(ALERT)
NetR163_2: R163.2 TP99.1
NetR179_2: R179.2 TP100.1
NetR217_2: R217.2 TP64.1
NetR218_2: R218.2 TP65.1
NetR307_1: R307.1 TP66.1
NetR308_2: R308.2 TP67.1
NetR312_2: R312.2 TP101.1
NetR315_2: R315.2 TP102.1
NetR343_2: R343.2 TP57.1
NetR344_2: R344.2 TP58.1

Not connected (* = marked no-connect by the designer): U36 40(OUT7+)* 41(OUT7-)* 42(OUT6+)* 43(OUT6-)* 45(OUT5+)* 46(OUT5-)* 47(OUT4-)* 48(OUT4+)* 49(OUT3+)* 50(OUT3-)* 51(OUT2-)* 52(OUT2+)* 54(OUT1+)* 55(OUT1-)* 56(OUT0-)* 57(OUT0+)*

### Layout directives
differential pair; differential pair class D100: DRS4_IN0_N, DRS4_IN0_P, DRS4_IN1_N, DRS4_IN1_P, DRS4_IN2_N, DRS4_IN2_P, DRS4_IN3_N, DRS4_IN3_P, DRS4_IN4_N, DRS4_IN4_P, DRS4_IN5_N, DRS4_IN5_P, DRS4_IN6_N, DRS4_IN6_P, DRS4_IN7_N, DRS4_IN7_P, DRS4_IN8_N, DRS4_IN8_P
differential pair: DRS4_AVDD_N, DRS4_AVDD_P, DRS4_DVDD_N, DRS4_DVDD_P

### Notes on the sheet
- DSPEED: 2GHz @ 1V
- ADDRESS: 0X40
- Adjust CLK Termination if needed
- (near U36) D100
- (near U38) ADDRESS: 0X4E
- Via Test Point
- (near U39) ADDRESS: 0X48
- Sense Resistor is placed before regulator input.  Sense resistor can potentionally affect the regulator's transient response. DRS4_2V5_REG_IN connects to regulators used to supply Digital DRS4 Supply rail.
- 475 Portola Plaza
- GAPS TOF
- igarcia91@g.ucla.edu
- Los Angeles, CA
- 310-825-0344
- Size:
- Date:
- Letter
- Number:
- Time:
- Sheet
- Revision:
- of
- andrew.peck@cern.ch
- spq@ucla.edu
- File:
- (in symbol DRS4) DRS4_QFN76; WRITE; IN+; BUF; OUT; IN-; READ

### Library data of the parts
C1-C3 C66 C110 = Cap_Kemet_T521B226M025ATE100_22uF: Tantalum Capacitors - Polymer SMD 25V 22uF 1311 20% ESR=100mOhms; Supplier Part Number 1: 80-T521B226M25ATE100; Supplier 1: Mouser
C126 = CMP-03020-007524-1: CAP CER 5600PF 50V X7R 0402 / C0402C562K5RACTU; Manufacturer: Kemet; Temperature Coefficient: 15%; Tolerance: 0.1; Material: Ceramic; Value: 5,600 pF; Temperature Characteristic: X7R; Device Class L3: Ceramic Capacitors; Height: 0.55mm; Temperature: -55°C to +125°C; Package: C0402-BB; Category: Cap; ComponentLink2Description: Datasheet; Device Class L2: Capacitors; Automotive: No; Device Class L1: Passive Components; Lead Free: Yes; ComponentLink2URL: https://content.kemet.com/datasheets/KEM_C1002_X7R_SMD.pdf; Digikey Description: CAP CER 5600PF 50V X7R 0402; Temperature Range High: +125°C; RoHS: TRUE; Octopart: https://octopart.com/c0402c562k5ractu-kemet-98458; Temperature Range Low: -55°C; Ipc Land Pattern Name: CAPC10050X50; Voltage Rating: 50 V; Mouser Description: Multilayer Ceramic Capacitors MLCC - SMD/SMT 50volts 5600pF X7R 10%; Manufacturer Part Number: C0402C562K5RACTU; Capacitance: 5,600 pF
C135-C137 C141 C143-C149 C155-C159 C161-C165 = Cap_Taiyo_Yuden_TMK105B7104KV-FR_100nF: CAP CER 100nF 25V X7R 0402; Supplier 1: Mouser; Supplier Part Number 1: 963-TMK105B7104KV-FR
C138 = Cap_Murata_GRT21BR61E226ME13L_22uF: CAP CER 22uF 25V X5R 0805; Supplier 1: Mouser; Supplier Part Number 1: 81-GRT21BR61E226ME3L
C139 = Cap_Murata_GCJ188R71E105KA01J_1uF: CAP CER 1uF 25V X7R 0603; Supplier 1: Mouser; Supplier Part Number 1: 81-GCJ188R71E105KA1J
C140 = CMP-1035-02189-1: CAP 4.7nF 10V ±10% 0603 (1608 Metric) Thickness 1mm SMD; Case-Metric: 1608; Tolerance: Â±10%; Case-EIA: 0603; Max Thickness: 1 mm; Technology: SMT; Rated Voltage: 10 V; Value: 4.7nF
C142 C150 C160 = Cap_Murata_ GRM21BC71E106ME11L_10uF: CAP CER 10uF 25V X7R 0805; Supplier 1: Mouser; Supplier Part Number 1: 81-GRM21BC71E106ME1L
C151 C166 = Cap_Murata_GRM31CR61A107ME05L_100uF: CAP CER 100uF 25V X5R 0603; Supplier Part Number 1: 81-GRM31CR61A107ME5L; Supplier 1: Mouser
C152-C154 C167 C168 = Cap_Kemet_C0603C101J5RACTU_100pF: CAP CER 100pF 50V X7R 0603; Supplier 1: Mouser; Supplier Part Number 1: 80-C0603C101J5R
D24-D26 = Led_Lite-On_LTST-C193KGKT-5A_Red: Standard LEDs - SMD Red 470nm 28mcd 20mA; Supplier 1: Mouser; Supplier Part Number 1: 859-LTSTC193KRKT5A; Series: LTST-C193KRKT-5A
FB9 = Feb_MURATA_BLM15AX300SZ1D_30: Feb SMD 30 OHM 25% 3/4W 0402; Supplier 1: Mouser; Supplier Part Number 1: 81-BLM15AX300SZ1D
J3-J5 = Header_TE_Connectivity_826936-2_2POS_5A: Headers & Wire Housings 2P SINGLE ROW 5A; Supplier Part Number 1: 571-826936-2; Supplier 1: Mouser
Q13-Q15 = BJT_PNP_Toshiba_TMBT3906: Bipolar Transistors - BJT Transistor for Low Freq. Amplification; Supplier 1: Mouser; Supplier Part Number 1: TMBT3906,LM
R31 R33 R35 R57-R60 R109 R110 R113 R114 R163 R179 R217 R218 R307 R308 R312 R315 R343 R344 = CMP-1011-00514-1: 1K1 0.063W 1% 0402 (1005 Metric)  SMD; Case-Metric: 1005; Case-EIA: 0402; Value: 1100.00 Ohm; Power: 0.063 W; Tolerance: 1 %; Technology: SMT
R102 R116 = SRes_KOA_PSG4NTEB1L00F_1mOhm: Current Sense Resistors - SMD 1mOhm 8W 1% 50ppm AEC-Q200 Power Shunt; Supplier 1: Mouser; Supplier Part Number 1: 660-PSG4NTEB1L00F
R103 R105 R108 R117 R120 = Res_Vishay_CRCW04020000Z0EDC_0_Ohm: 0R 0.062W 1% 0402 (1005 Metric)  SMD; Supplier 1: Mouser; Supplier Part Number 1: 71-CRCW04020000Z0EDC
R104 R118 R119 = CMP-1012-00122-1: 100K 0.1W 5% 0603 (1608 Metric)  SMD; Case-EIA: 0603; Value: 100000.00 Ohm; Case-Metric: 1608; Tolerance: 5 %; Power: 0.1 W; Technology: SMT
R106 R168 R169 R184 R185 R345-R349 R362 = CMP-1011-00050-1: 100R 0.063W 5% 0402 (1005 Metric)  SMD; Case-EIA: 0402; Value: 100.00 Ohm; Case-Metric: 1005; Tolerance: 5 %; Technology: SMT; Power: 0.063 W
R107 R121 R122 = CMP-1012-00098-1: 10K 0.1W 5% 0603 (1608 Metric)  SMD; Case-EIA: 0603; Value: 10000.00 Ohm; Case-Metric: 1608; Technology: SMT; Tolerance: 5 %; Power: 0.1 W
R111 = CMP-1012-00053-1: 130R 0.1W 5% 0603 (1608 Metric)  SMD; Case-Metric: 1608; Case-EIA: 0603; Value: 130.00 Ohm; Technology: SMT; Tolerance: 5 %; Power: 0.1 W
R112 R123 R124 = CMP-1012-00070-1: 680R 0.1W 5% 0603 (1608 Metric)  SMD; Case-EIA: 0603; Value: 680.00 Ohm; Case-Metric: 1608; Tolerance: 5 %; Technology: SMT; Power: 0.1 W
R115 = CMP-1011-00363-1: 49R9 0.063W 1% 0402 (1005 Metric)  SMD; Case-EIA: 0402; Case-Metric: 1005; Value: 49.90 Ohm; Power: 0.063 W; Technology: SMT; Tolerance: 1 %
TP18 TP38 TP39 TP42-TP44 TP68 = TP_Keystone_Electronics_5006: Circuit Board Hardware - PCB TEST POINT BLK .063; Supplier 1: Mouser; Supplier Part Number 1: 534-5006
TP57-TP67 TP97-TP102 = TP_TE_Connectivity_5-146280-1_1POS: Headers & Wire Housings Unshrouded 1 POS T/H; Supplier Part Number 1: 571-51462801; Supplier 1: Mouser
U36 = DRS4: DRS4 QFN76 DAQ Chip; Series: DRS4
U37 U38 = INA226AQDGSRQ1: Current & Power Monitors & Regulators Automotive, 36-V, Ultra-High Accuracy, Low-/High-Side, I2C Out Current/Power Monitor w/ Alert 10-VSSOP -40 to 125; Supplier 1: Mouser; Supplier Part Number 1: 595-INA226AQDGSRQ1
U39 = TMP112AIDRLR: Board Mount Temperature Sensors Hi-Prec Lo-Pwr Dig Temp Sensor; Supplier 1: Mouser; Supplier Part Number 1: 595-TMP112AIDRLR